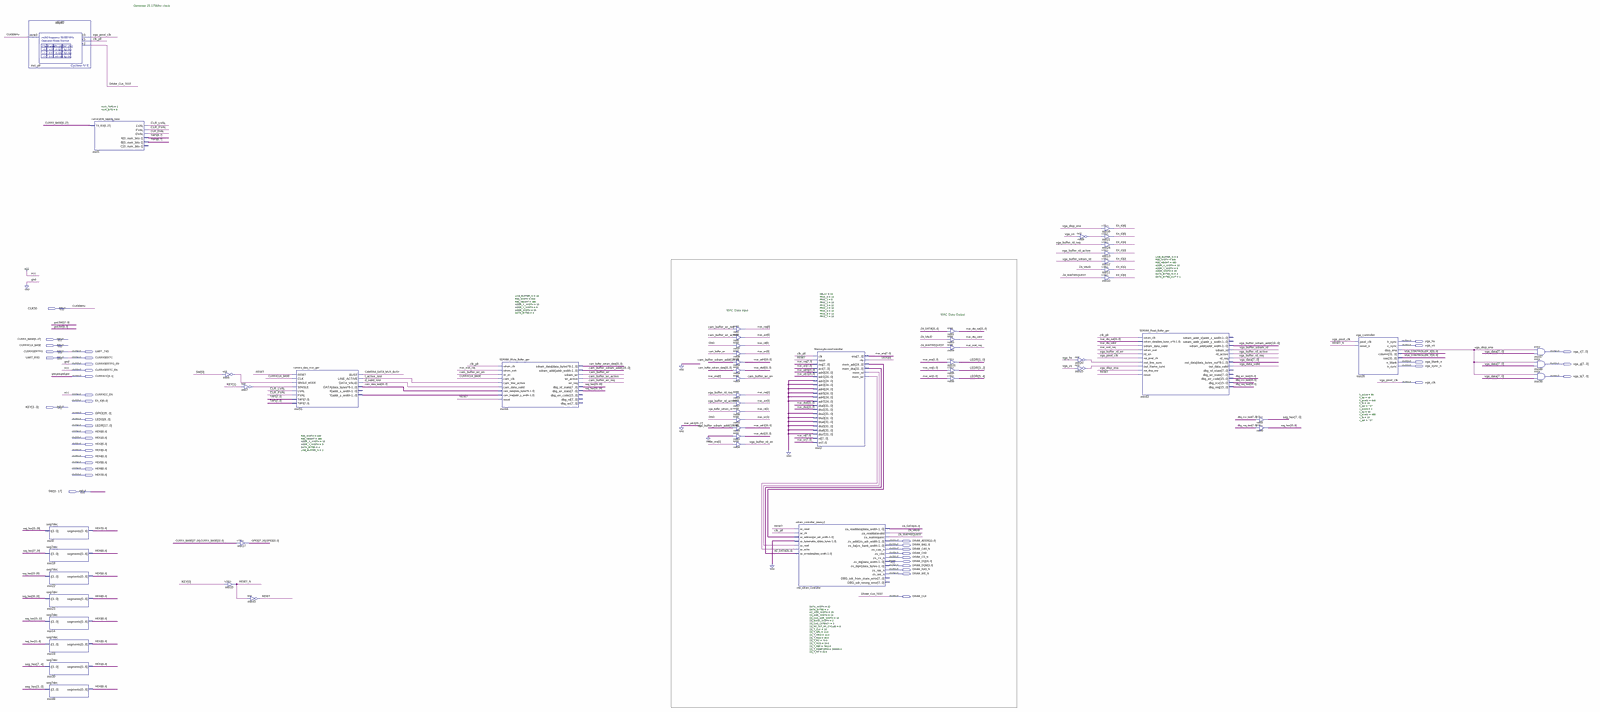
[diagram p0: schematic sheet, whole]
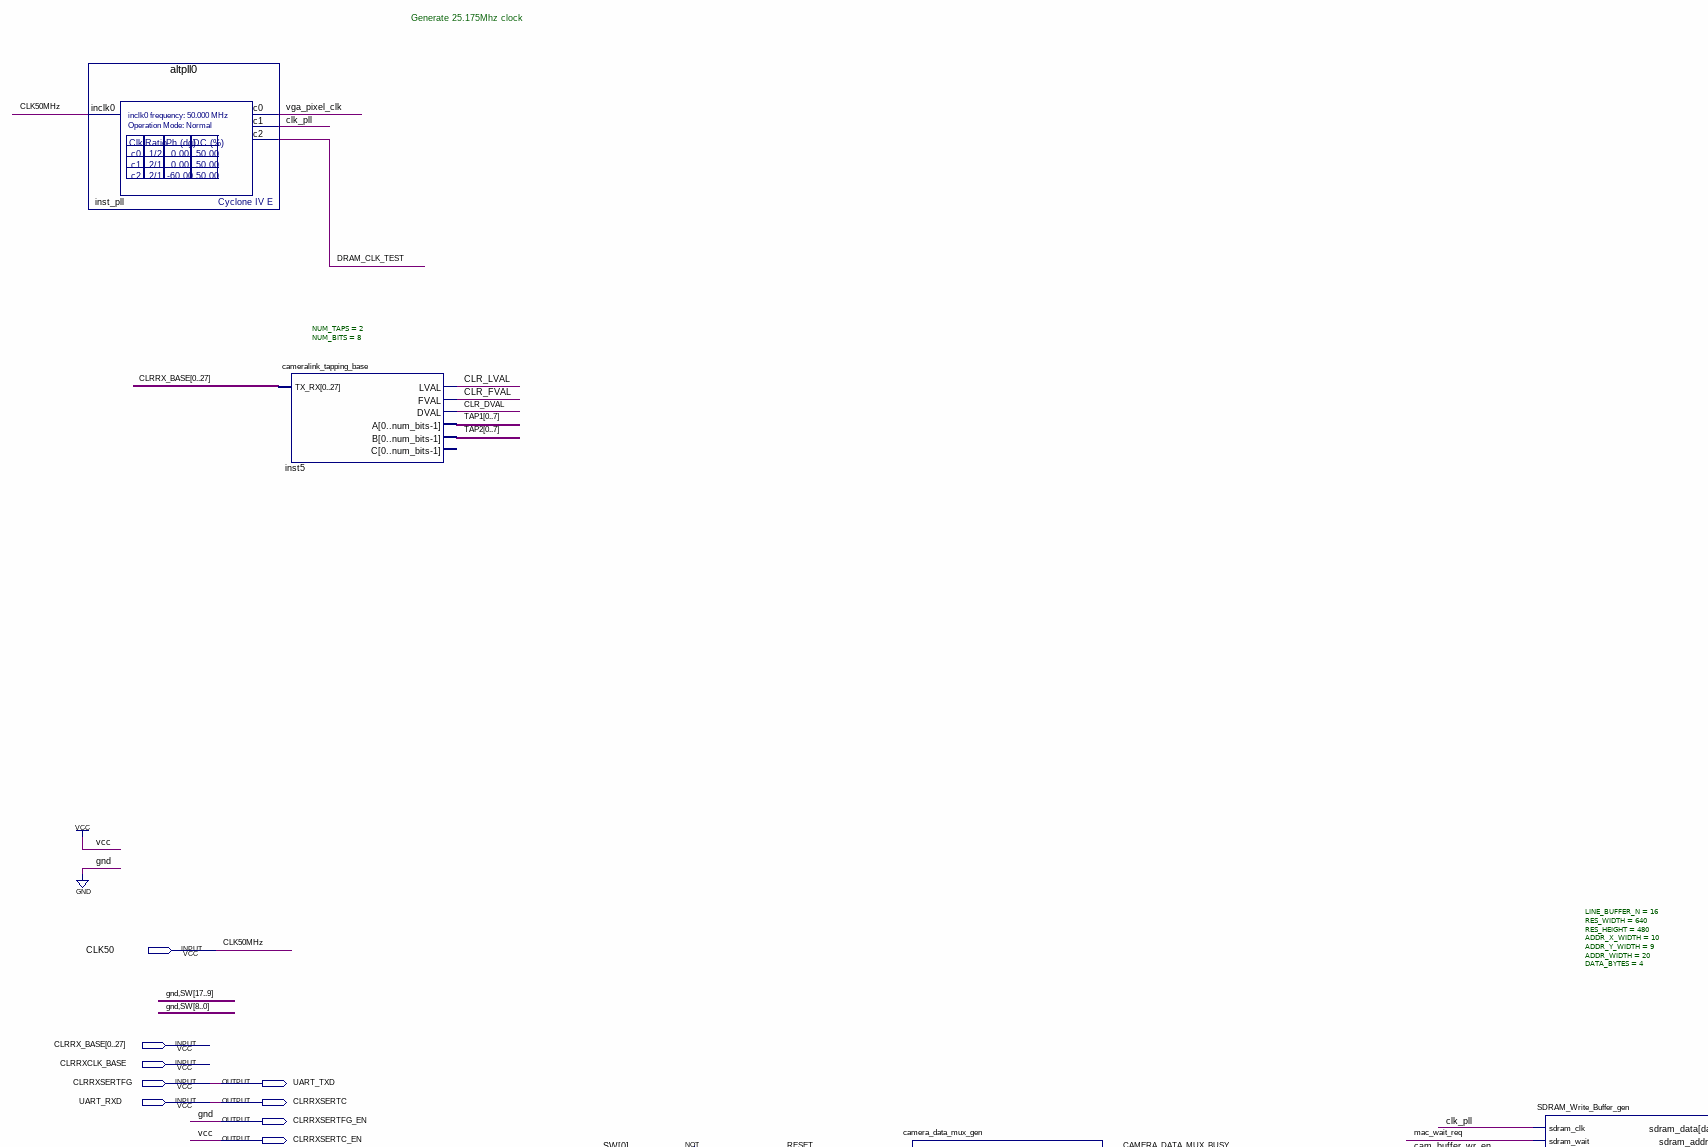
[diagram p1: schematic sheet, upper left part]
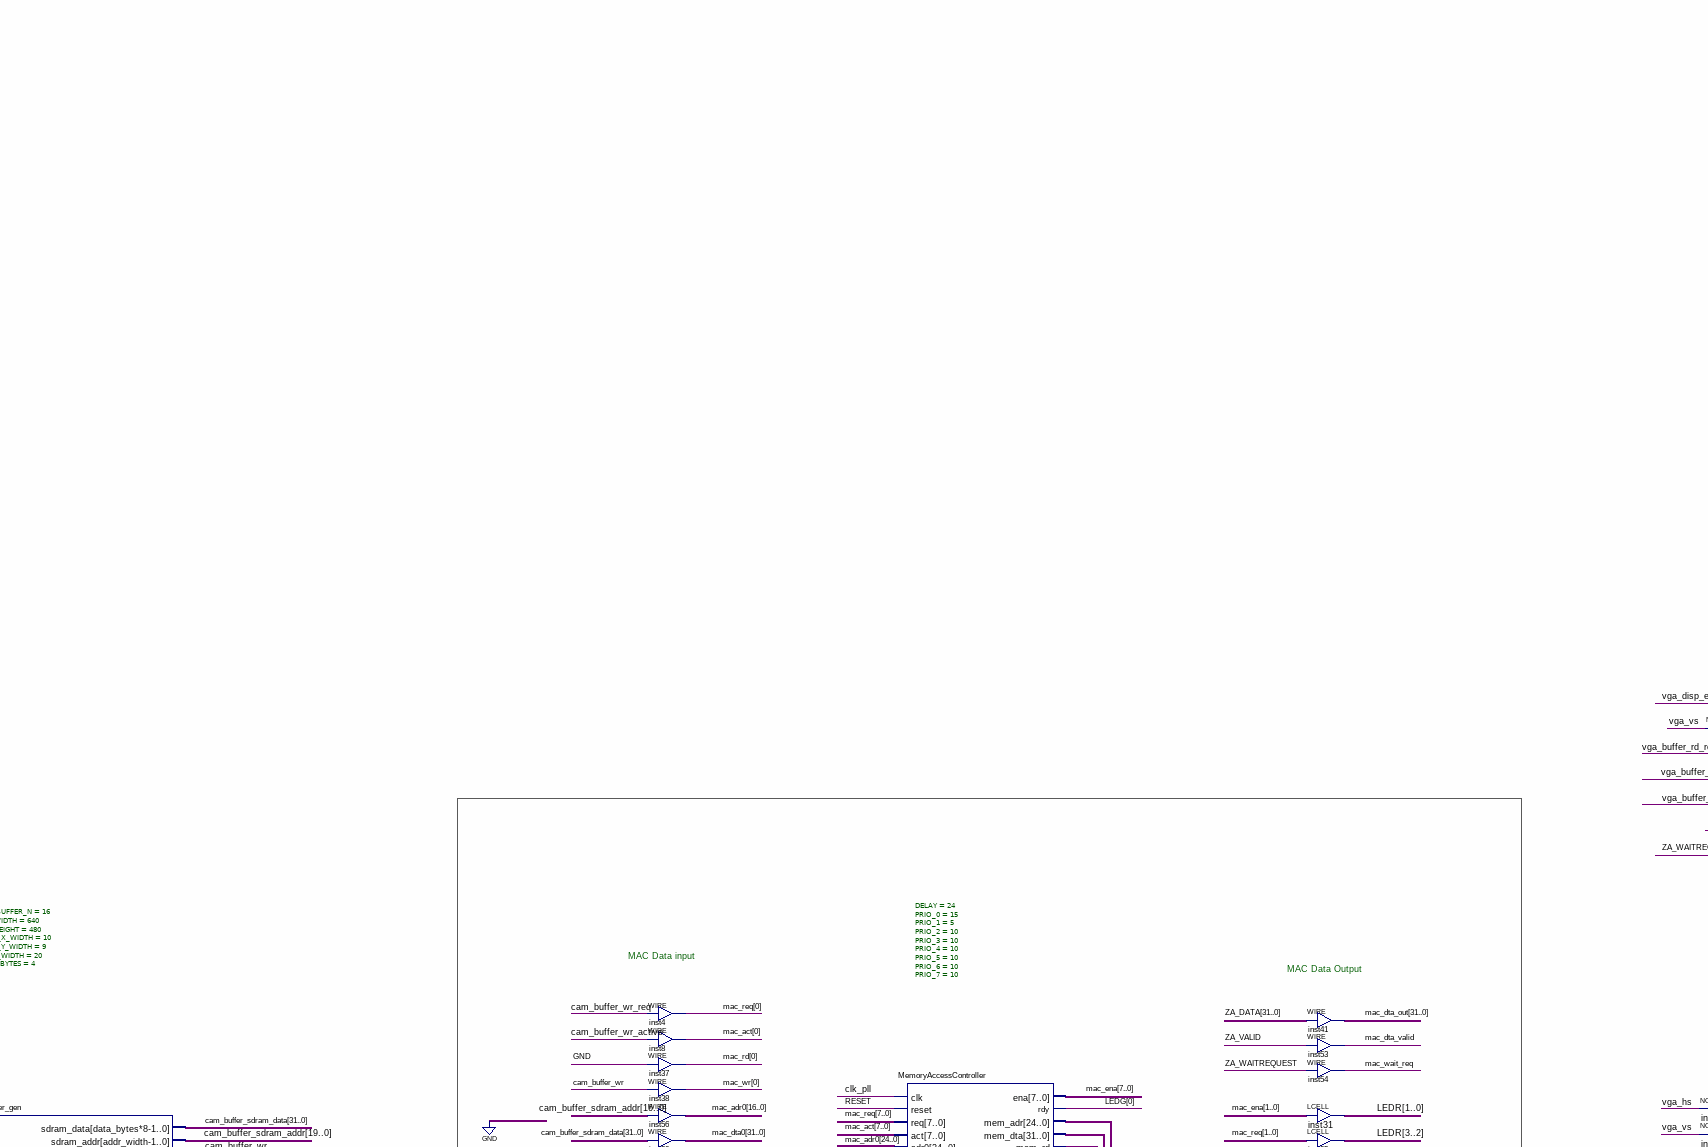
[diagram p2: schematic sheet, upper centre part]
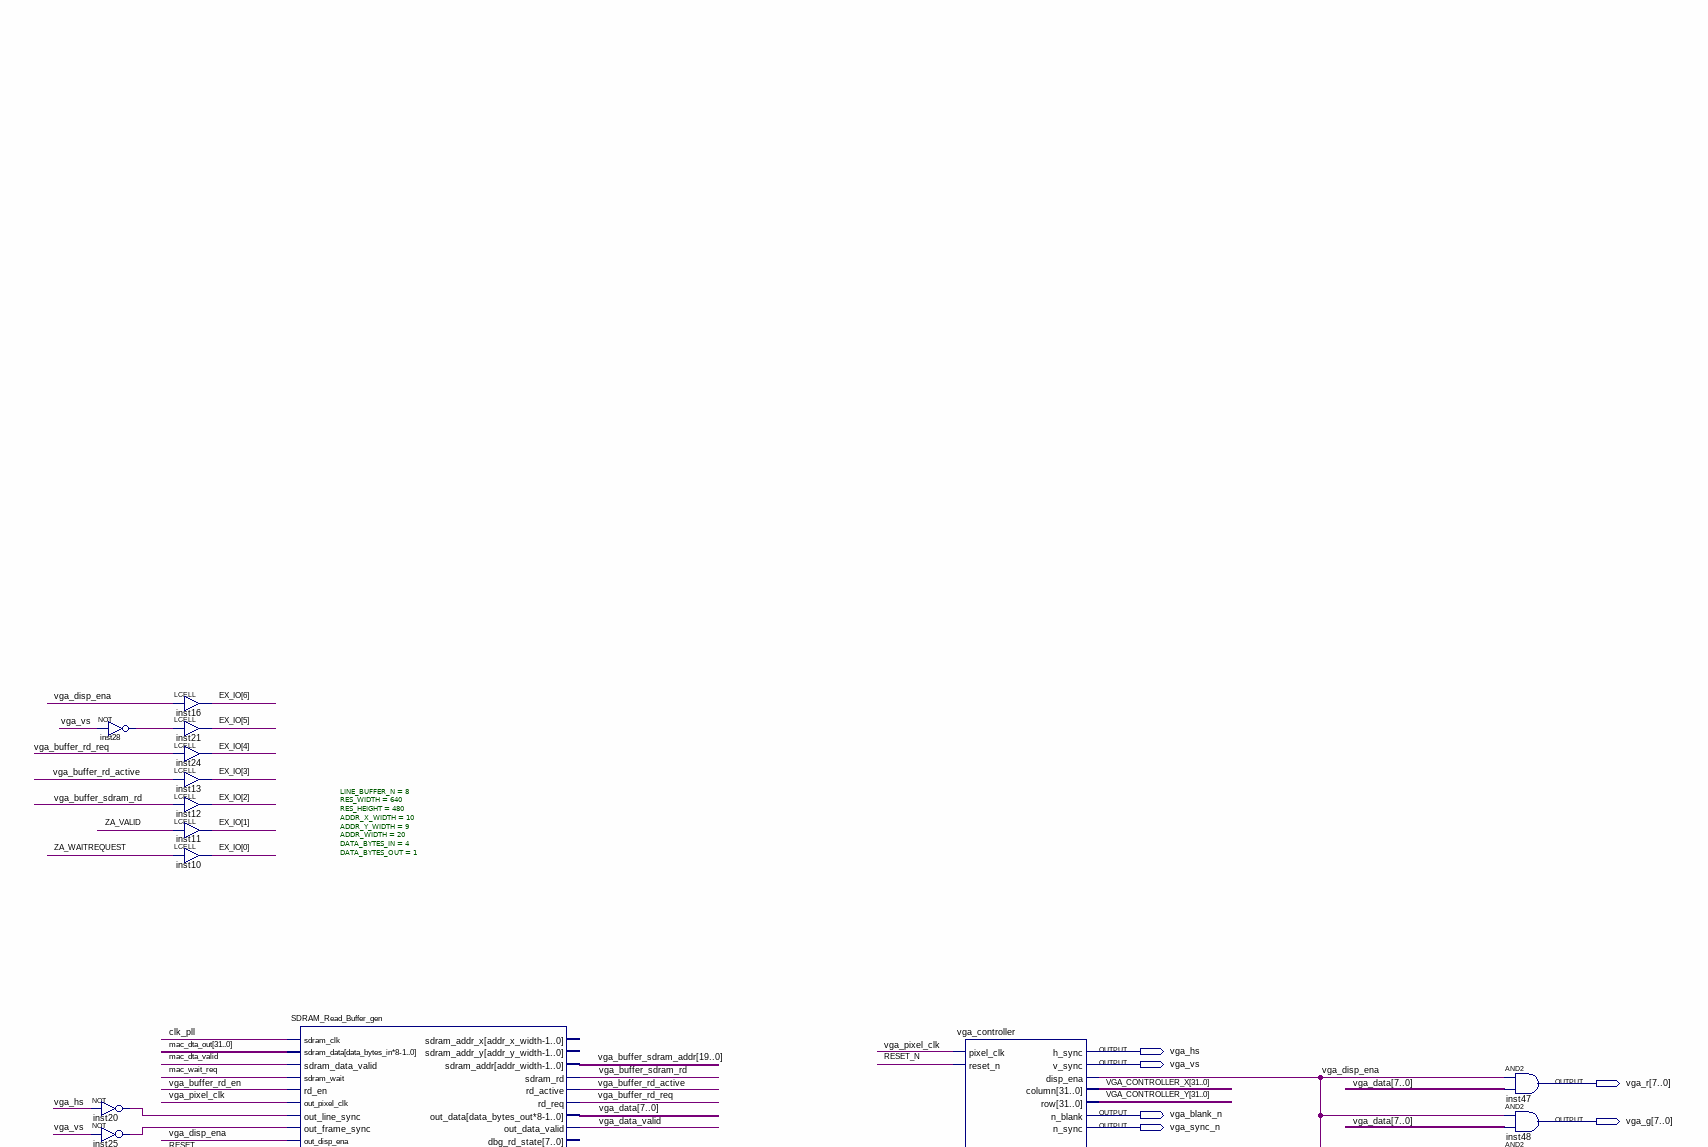
[diagram p3: schematic sheet, upper right part]
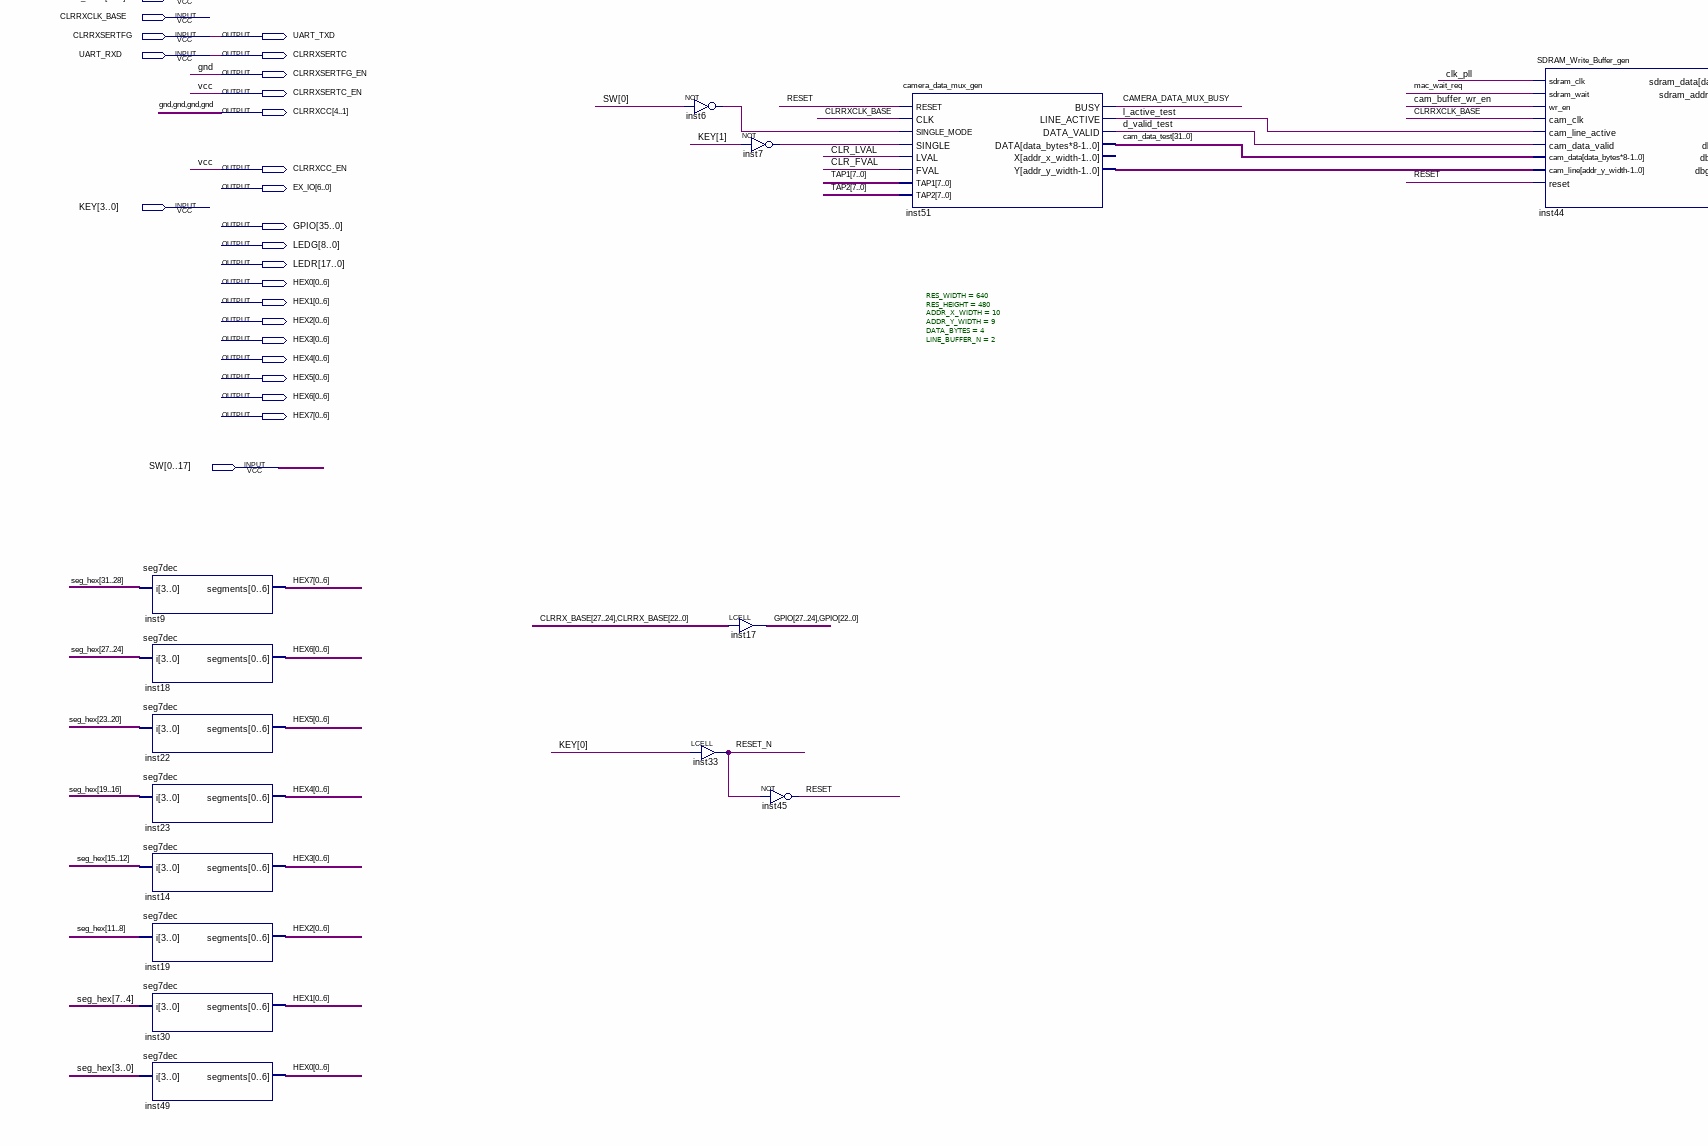
[diagram p4: schematic sheet, lower left part]
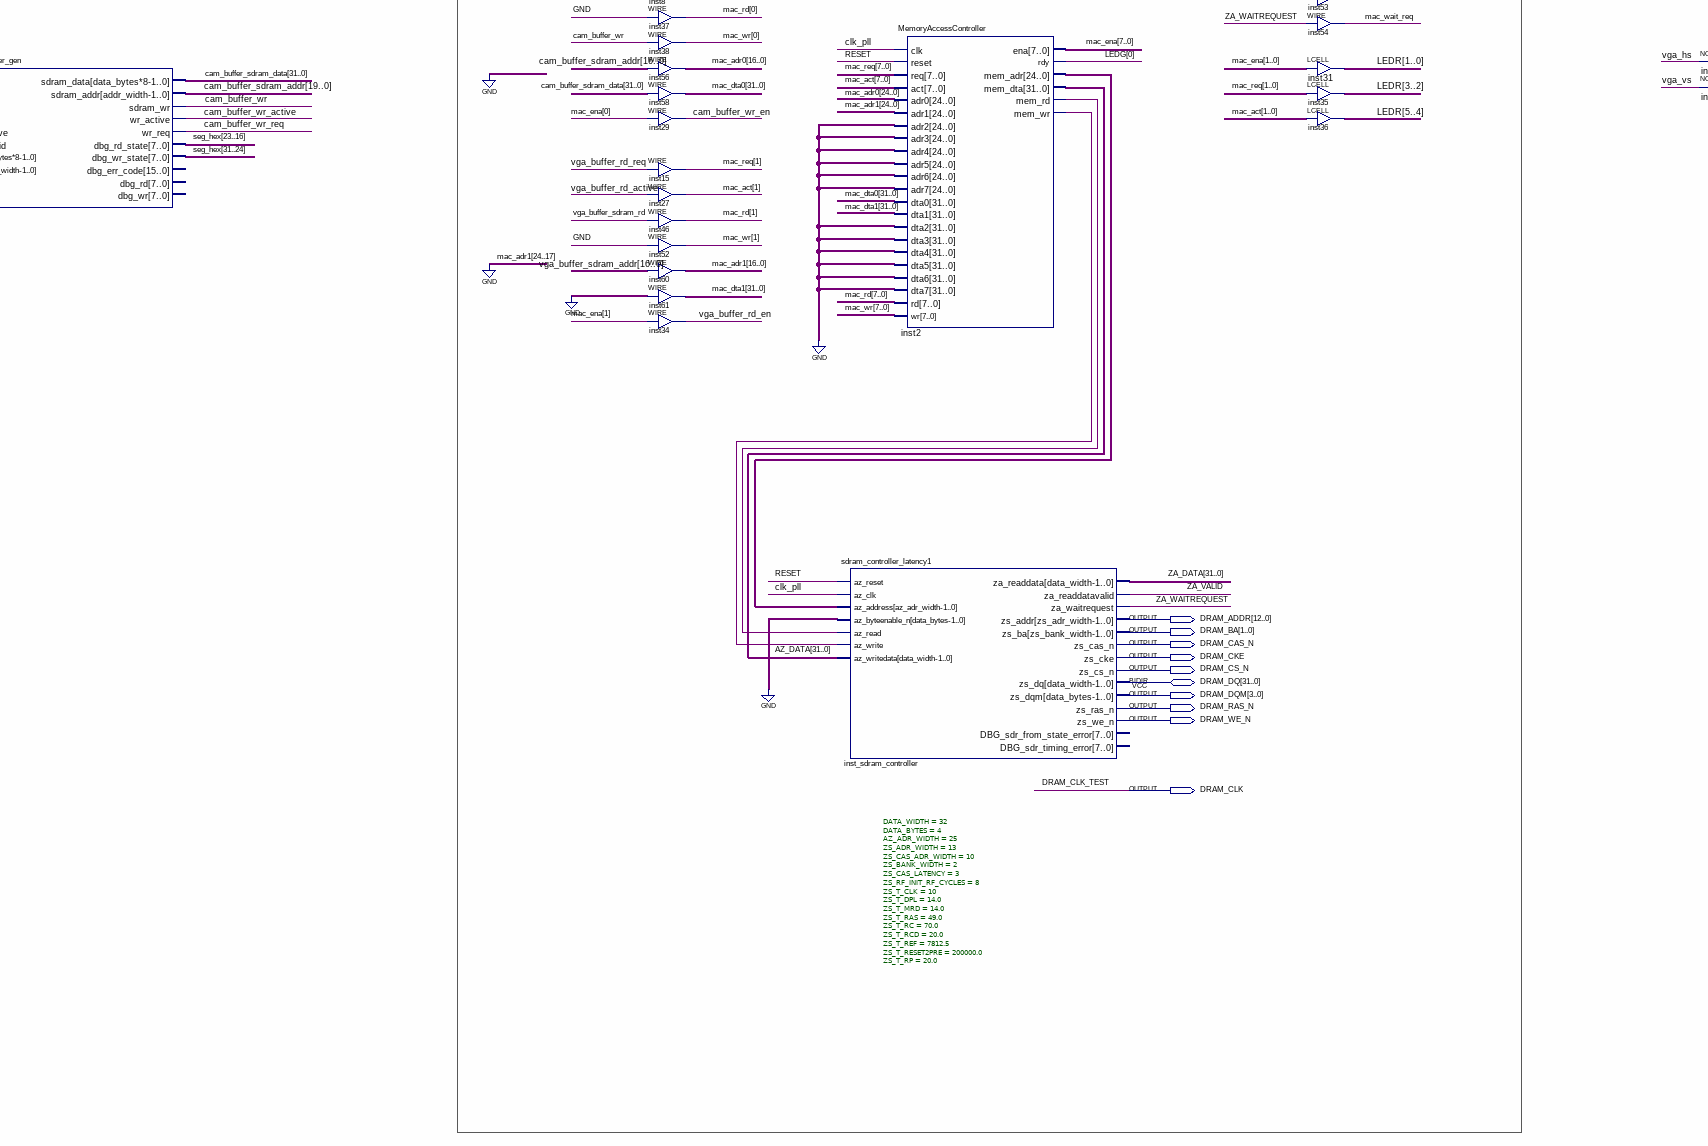
[diagram p5: schematic sheet, lower centre part]
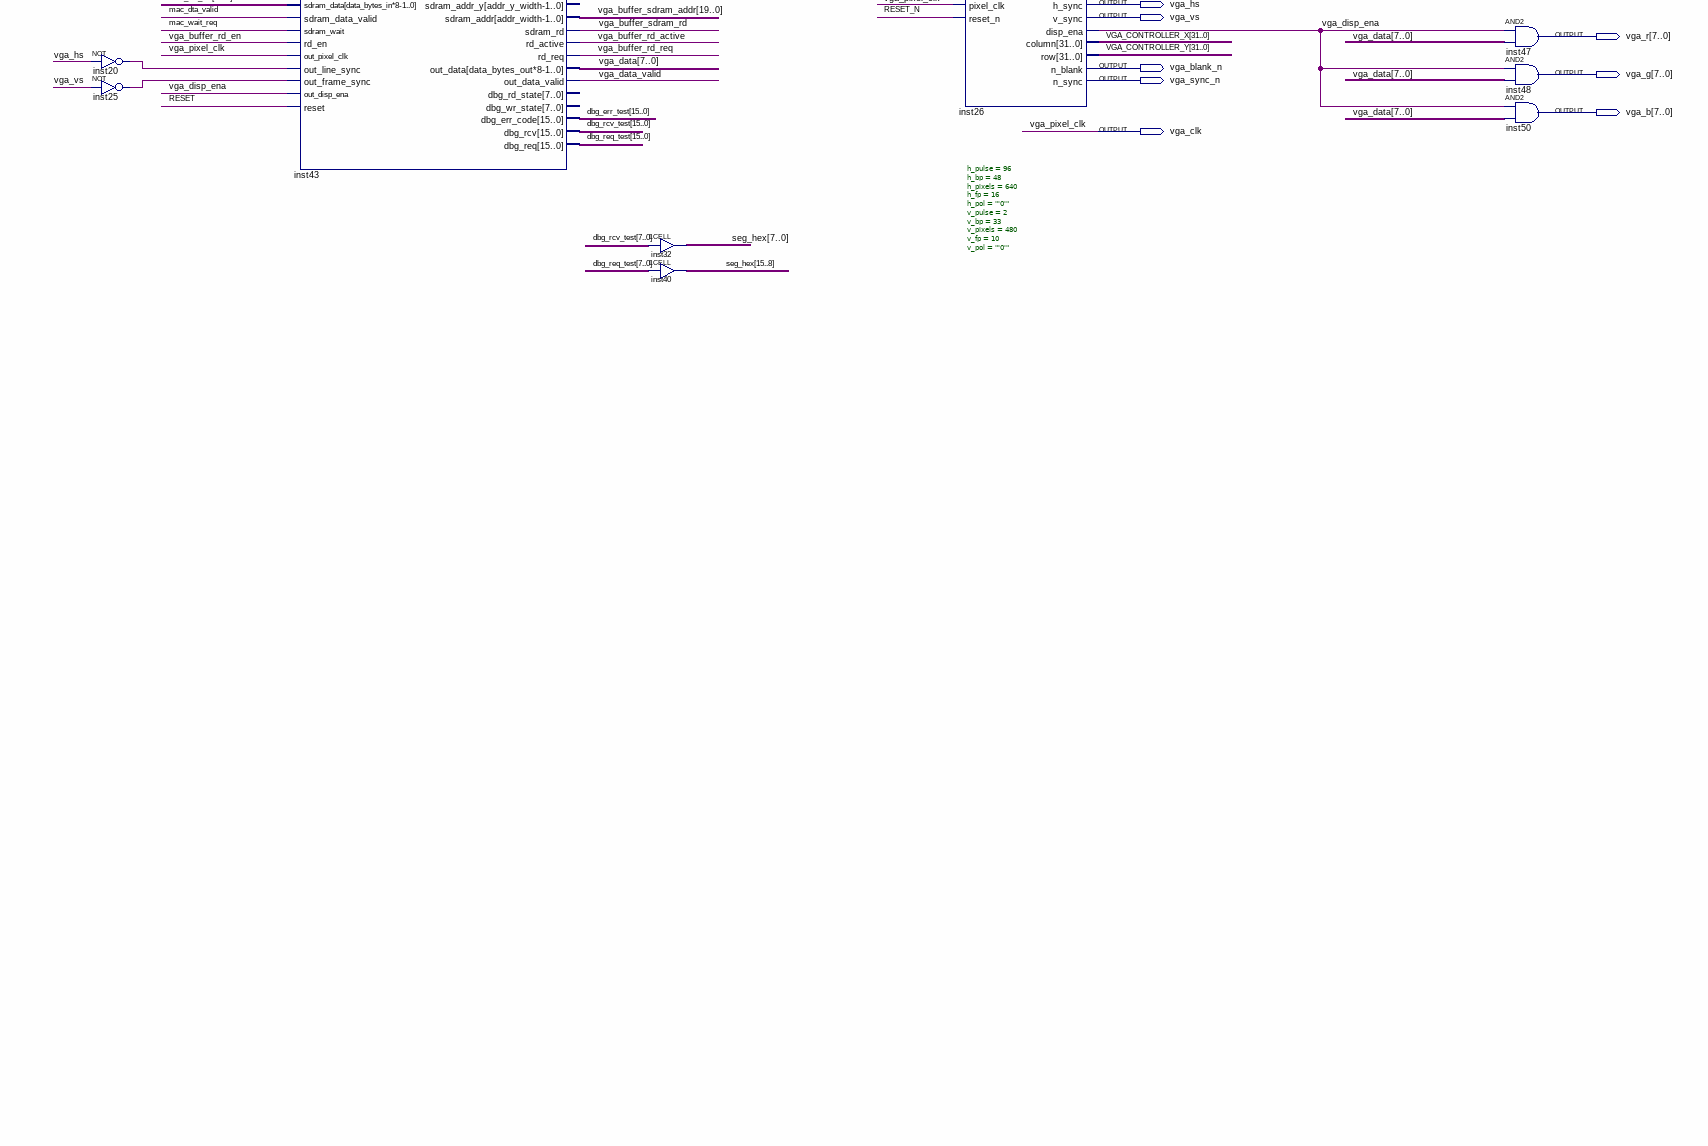
[diagram p6: schematic sheet, lower right part]
// Quartus schematic sdram-mac.bdf as structural Verilog: 56 symbols, 43 pins
module \sdram-mac  (
  input  CLK50,
  input  [0:27] CLRRX_BASE,
  input  CLRRXCLK_BASE,
  input  CLRRXSERTFG,
  input  UART_RXD,
  input  [3:0] KEY,
  input  [0:17] SW,
  inout  [31:0] DRAM_DQ,
  output vga_hs,
  output vga_vs,
  output UART_TXD,
  output [7:0] vga_r,
  output CLRRXSERTC,
  output vga_blank_n,
  output CLRRXSERTFG_EN,
  output [7:0] vga_g,
  output vga_sync_n,
  output CLRRXSERTC_EN,
  output [4:1] CLRRXCC,
  output [7:0] vga_b,
  output vga_clk,
  output CLRRXCC_EN,
  output [6:0] EX_IO,
  output [35:0] GPIO,
  output [8:0] LEDG,
  output [17:0] LEDR,
  output [0:6] HEX0,
  output [0:6] HEX1,
  output [0:6] HEX2,
  output [0:6] HEX3,
  output [0:6] HEX4,
  output [0:6] HEX5,
  output [0:6] HEX6,
  output [0:6] HEX7,
  output [12:0] DRAM_ADDR,
  output [1:0] DRAM_BA,
  output DRAM_CAS_N,
  output DRAM_CKE,
  output DRAM_CS_N,
  output [3:0] DRAM_DQM,
  output DRAM_RAS_N,
  output DRAM_WE_N,
  output DRAM_CLK
);

  wire cam_buffer_wr, cam_buffer_wr_active, cam_buffer_wr_en, cam_buffer_wr_req, CAMERA_DATA_MUX_BUSY,
       clk_pll, CLR_DVAL, CLR_FVAL, CLR_LVAL, d_valid_test, inst2_mem_rd, inst2_mem_wr, inst6_out, inst7_out,
       inst20_out, inst25_out, inst28_out, l_active_test, mac_dta_valid, mac_wait_req, RESET, RESET_N,
       vga_buffer_rd_active, vga_buffer_rd_en, vga_buffer_rd_req, vga_buffer_sdram_rd, vga_data_valid,
       vga_disp_ena, ZA_VALID, ZA_WAITREQUEST;
  wire [7:0] mac_act, mac_ena, mac_rd, mac_req, mac_wr, TAP1, TAP2, vga_data;
  wire [8:0] inst51_y;
  wire [15:0] dbg_err_test, dbg_rcv_test, dbg_req_test;
  wire [16:0] mac_adr1;
  wire [19:0] cam_buffer_sdram_addr, vga_buffer_sdram_addr;
  wire [24:0] inst2_mem_adr, mac_adr0;
  wire [31:0] AZ_DATA, cam_buffer_sdram_data, cam_data_test, mac_dta0, mac_dta1, mac_dta_out, seg_hex,
       VGA_CONTROLLER_X, VGA_CONTROLLER_Y, ZA_DATA;

  altpll0 inst_pll (.inclk0(CLK50), .c0(vga_clk), .c1(clk_pll), .c2(DRAM_CLK));
  seg7dec inst9 (.i(seg_hex[31:28]), .segments(HEX7));
  seg7dec inst18 (.i(seg_hex[27:24]), .segments(HEX6));
  seg7dec inst22 (.i(seg_hex[23:20]), .segments(HEX5));
  seg7dec inst23 (.i(seg_hex[19:16]), .segments(HEX4));
  seg7dec inst14 (.i(seg_hex[15:12]), .segments(HEX3));
  seg7dec inst19 (.i(seg_hex[11:8]), .segments(HEX2));
  seg7dec inst30 (.i(seg_hex[7:4]), .segments(HEX1));
  seg7dec inst49 (.i(seg_hex[3:0]), .segments(HEX0));
  cameralink_tapping_base #(.NUM_TAPS(2), .NUM_BITS(8)) inst5 (
    .TX_RX(CLRRX_BASE), .LVAL(CLR_LVAL), .FVAL(CLR_FVAL), .DVAL(CLR_DVAL),
    .A({TAP1[0], TAP1[1], TAP1[2], TAP1[3], TAP1[4], TAP1[5], TAP1[6], TAP1[7]}),
    .B({TAP2[0], TAP2[1], TAP2[2], TAP2[3], TAP2[4], TAP2[5], TAP2[6], TAP2[7]}));  // open: C
  not inst6 (inst6_out, SW[0]);
  LCELL inst33 (.IN(KEY[0]), .OUT(RESET_N));
  not inst7 (inst7_out, KEY[1]);
  LCELL inst17[26:0] (
    .IN({CLRRX_BASE[27], CLRRX_BASE[26], CLRRX_BASE[25], CLRRX_BASE[24], CLRRX_BASE[22], CLRRX_BASE[21], CLRRX_BASE[20], CLRRX_BASE[19], CLRRX_BASE[18], CLRRX_BASE[17], CLRRX_BASE[16], CLRRX_BASE[15], CLRRX_BASE[14], CLRRX_BASE[13], CLRRX_BASE[12], CLRRX_BASE[11], CLRRX_BASE[10], CLRRX_BASE[9], CLRRX_BASE[8], CLRRX_BASE[7], CLRRX_BASE[6], CLRRX_BASE[5], CLRRX_BASE[4], CLRRX_BASE[3], CLRRX_BASE[2], CLRRX_BASE[1], CLRRX_BASE[0]}),
    .OUT({GPIO[27:24], GPIO[22:0]}));
  not inst45 (RESET, RESET_N);
  camera_data_mux_gen #(.RES_WIDTH(640), .RES_HEIGHT(480), .ADDR_X_WIDTH(10), .ADDR_Y_WIDTH(9), .DATA_BYTES(4), .LINE_BUFFER_N(2)) inst51 (
    .RESET(RESET), .CLK(CLRRXCLK_BASE), .SINGLE_MODE(inst6_out), .SINGLE(inst7_out), .LVAL(CLR_LVAL),
    .FVAL(CLR_FVAL), .TAP1(TAP1), .TAP2(TAP2), .BUSY(CAMERA_DATA_MUX_BUSY), .LINE_ACTIVE(l_active_test),
    .DATA_VALID(d_valid_test), .DATA(cam_data_test), .Y(inst51_y));  // open: X
  SDRAM_Write_Buffer_gen #(.LINE_BUFFER_N(16), .RES_WIDTH(640), .RES_HEIGHT(480), .ADDR_X_WIDTH(10), .ADDR_Y_WIDTH(9), .ADDR_WIDTH(20), .DATA_BYTES(4)) inst44 (
    .sdram_clk(clk_pll), .sdram_wait(mac_wait_req), .wr_en(cam_buffer_wr_en), .cam_clk(CLRRXCLK_BASE),
    .cam_line_active(l_active_test), .cam_data_valid(d_valid_test), .cam_data(cam_data_test),
    .cam_line(inst51_y), .reset(RESET), .sdram_data(cam_buffer_sdram_data),
    .sdram_addr(cam_buffer_sdram_addr), .sdram_wr(cam_buffer_wr), .wr_active(cam_buffer_wr_active),
    .wr_req(cam_buffer_wr_req), .dbg_rd_state(seg_hex[23:16]), .dbg_wr_state(seg_hex[31:24]));  // open: dbg_err_code, dbg_rd, dbg_wr
  assign mac_req[0] = cam_buffer_wr_req;  // WIRE inst4
  assign mac_act[0] = cam_buffer_wr_active;  // WIRE inst8
  assign mac_rd[0] = 1'b0;  // WIRE inst37
  assign mac_wr[0] = cam_buffer_wr;  // WIRE inst38
  assign mac_adr0[16:0] = cam_buffer_sdram_addr[16:0];  // WIRE inst56
  assign mac_dta0 = cam_buffer_sdram_data;  // WIRE inst58
  assign cam_buffer_wr_en = mac_ena[0];  // WIRE inst29
  assign mac_req[1] = vga_buffer_rd_req;  // WIRE inst15
  assign mac_act[1] = vga_buffer_rd_active;  // WIRE inst27
  assign mac_rd[1] = vga_buffer_sdram_rd;  // WIRE inst46
  assign mac_wr[1] = 1'b0;  // WIRE inst52
  assign mac_adr1 = vga_buffer_sdram_addr[16:0];  // WIRE inst60
  assign mac_dta1 = {32{1'b0}};  // WIRE inst61
  assign vga_buffer_rd_en = mac_ena[1];  // WIRE inst34
  sdram_controller_latency1 #(.DATA_WIDTH(32), .DATA_BYTES(4), .AZ_ADR_WIDTH(25), .ZS_ADR_WIDTH(13), .ZS_CAS_ADR_WIDTH(10), .ZS_BANK_WIDTH(2), .ZS_CAS_LATENCY(3), .ZS_RF_INIT_RF_CYCLES(8), .ZS_T_CLK(10), .ZS_T_DPL(14.0), .ZS_T_MRD(14.0), .ZS_T_RAS(49.0), .ZS_T_RC(70.0), .ZS_T_RCD(20.0), .ZS_T_REF(7812.5), .ZS_T_RESET2PRE(200000.0), .ZS_T_RP(20.0)) inst_sdram_controller (
    .az_reset(RESET), .az_clk(clk_pll), .az_address(inst2_mem_adr), .az_byteenable_n(4'b0000),
    .az_read(inst2_mem_rd), .az_write(inst2_mem_wr), .az_writedata(AZ_DATA), .za_readdata(ZA_DATA),
    .za_readdatavalid(ZA_VALID), .za_waitrequest(ZA_WAITREQUEST), .zs_addr(DRAM_ADDR), .zs_ba(DRAM_BA),
    .zs_cas_n(DRAM_CAS_N), .zs_cke(DRAM_CKE), .zs_cs_n(DRAM_CS_N), .zs_dqm(DRAM_DQM), .zs_ras_n(DRAM_RAS_N),
    .zs_we_n(DRAM_WE_N), .zs_dq(DRAM_DQ));  // open: DBG_sdr_from_state_error, DBG_sdr_timing_error
  MemoryAccessController #(.DELAY(24), .PRIO_0(15), .PRIO_1(5), .PRIO_2(10), .PRIO_3(10), .PRIO_4(10), .PRIO_5(10), .PRIO_6(10), .PRIO_7(10)) inst2 (
    .clk(clk_pll), .reset(RESET), .req(mac_req), .act(mac_act), .adr0(mac_adr0),
    .adr1({{8{1'b0}}, mac_adr1}), .adr2({32{1'b0}}), .adr3({32{1'b0}}), .adr4({32{1'b0}}), .adr5({32{1'b0}}),
    .adr6({32{1'b0}}), .adr7({32{1'b0}}), .dta0(mac_dta0), .dta1(mac_dta1), .dta2({32{1'b0}}),
    .dta3({32{1'b0}}), .dta4({32{1'b0}}), .dta5({32{1'b0}}), .dta6({32{1'b0}}), .dta7({32{1'b0}}),
    .rd(mac_rd), .wr(mac_wr), .ena(mac_ena), .rdy(LEDG[0]), .mem_adr(inst2_mem_adr), .mem_dta(AZ_DATA),
    .mem_rd(inst2_mem_rd), .mem_wr(inst2_mem_wr));
  assign mac_dta_out = ZA_DATA;  // WIRE inst41
  assign mac_dta_valid = ZA_VALID;  // WIRE inst53
  assign mac_wait_req = ZA_WAITREQUEST;  // WIRE inst54
  LCELL inst31[1:0] (.IN(mac_ena[1:0]), .OUT(LEDR[1:0]));
  LCELL inst35[1:0] (.IN(mac_req[1:0]), .OUT(LEDR[3:2]));
  LCELL inst36[1:0] (.IN(mac_act[1:0]), .OUT(LEDR[5:4]));
  not inst20 (inst20_out, vga_hs);
  not inst25 (inst25_out, vga_vs);
  not inst28 (inst28_out, vga_vs);
  LCELL inst16 (.IN(vga_disp_ena), .OUT(EX_IO[6]));
  LCELL inst21 (.IN(inst28_out), .OUT(EX_IO[5]));
  LCELL inst24 (.IN(vga_buffer_rd_req), .OUT(EX_IO[4]));
  LCELL inst13 (.IN(vga_buffer_rd_active), .OUT(EX_IO[3]));
  LCELL inst12 (.IN(vga_buffer_sdram_rd), .OUT(EX_IO[2]));
  LCELL inst11 (.IN(ZA_VALID), .OUT(EX_IO[1]));
  LCELL inst10 (.IN(ZA_WAITREQUEST), .OUT(EX_IO[0]));
  SDRAM_Read_Buffer_gen #(.LINE_BUFFER_N(8), .RES_WIDTH(640), .RES_HEIGHT(480), .ADDR_X_WIDTH(10), .ADDR_Y_WIDTH(9), .ADDR_WIDTH(20), .DATA_BYTES_IN(4), .DATA_BYTES_OUT(1)) inst43 (
    .sdram_clk(clk_pll), .sdram_data(mac_dta_out), .sdram_data_valid(mac_dta_valid),
    .sdram_wait(mac_wait_req), .rd_en(vga_buffer_rd_en), .out_pixel_clk(vga_clk), .out_line_sync(inst20_out),
    .out_frame_sync(inst25_out), .out_disp_ena(vga_disp_ena), .reset(RESET),
    .sdram_addr(vga_buffer_sdram_addr), .sdram_rd(vga_buffer_sdram_rd), .rd_active(vga_buffer_rd_active),
    .rd_req(vga_buffer_rd_req), .out_data(vga_data), .out_data_valid(vga_data_valid),
    .dbg_err_code(dbg_err_test), .dbg_rcv(dbg_rcv_test), .dbg_req(dbg_req_test));  // open: sdram_addr_x, sdram_addr_y, dbg_rd_state, dbg_wr_state
  LCELL inst32[7:0] (.IN(dbg_rcv_test[7:0]), .OUT(seg_hex[7:0]));
  LCELL inst40[7:0] (.IN(dbg_req_test[7:0]), .OUT(seg_hex[15:8]));
  vga_controller #(.h_pulse(96), .h_bp(48), .h_pixels(640), .h_fp(16), .h_pol("'0'"), .v_pulse(2), .v_bp(33), .v_pixels(480), .v_fp(10), .v_pol("'0'")) inst26 (
    .pixel_clk(vga_clk), .reset_n(RESET_N), .h_sync(vga_hs), .v_sync(vga_vs), .disp_ena(vga_disp_ena),
    .column(VGA_CONTROLLER_X), .row(VGA_CONTROLLER_Y), .n_blank(vga_blank_n), .n_sync(vga_sync_n));
  assign vga_r = {8{vga_disp_ena}} & vga_data;  // AND2 inst47, 8 bits wide
  assign vga_g = {8{vga_disp_ena}} & vga_data;  // AND2 inst48, 8 bits wide
  assign vga_b = {8{vga_disp_ena}} & vga_data;  // AND2 inst50, 8 bits wide

  assign CLRRXCC = 4'b0000;
  assign CLRRXCC_EN = 1'b1;
  assign CLRRXSERTC = UART_RXD;
  assign CLRRXSERTC_EN = 1'b1;
  assign CLRRXSERTFG_EN = 1'b0;
  assign UART_TXD = CLRRXSERTFG;

  // Other names for the same wires on the sheet: CLK50MHz = CLK50; DRAM_CLK_TEST = DRAM_CLK; vga_pixel_clk = vga_clk

  // Notes on the sheet:
  //   Generate 25.175Mhz clock
  //   MAC Data input
  //   MAC Data Output
endmodule
